# EasyEDA schematic 1-Schematic_WELCOME HOME PCB BOARD.json
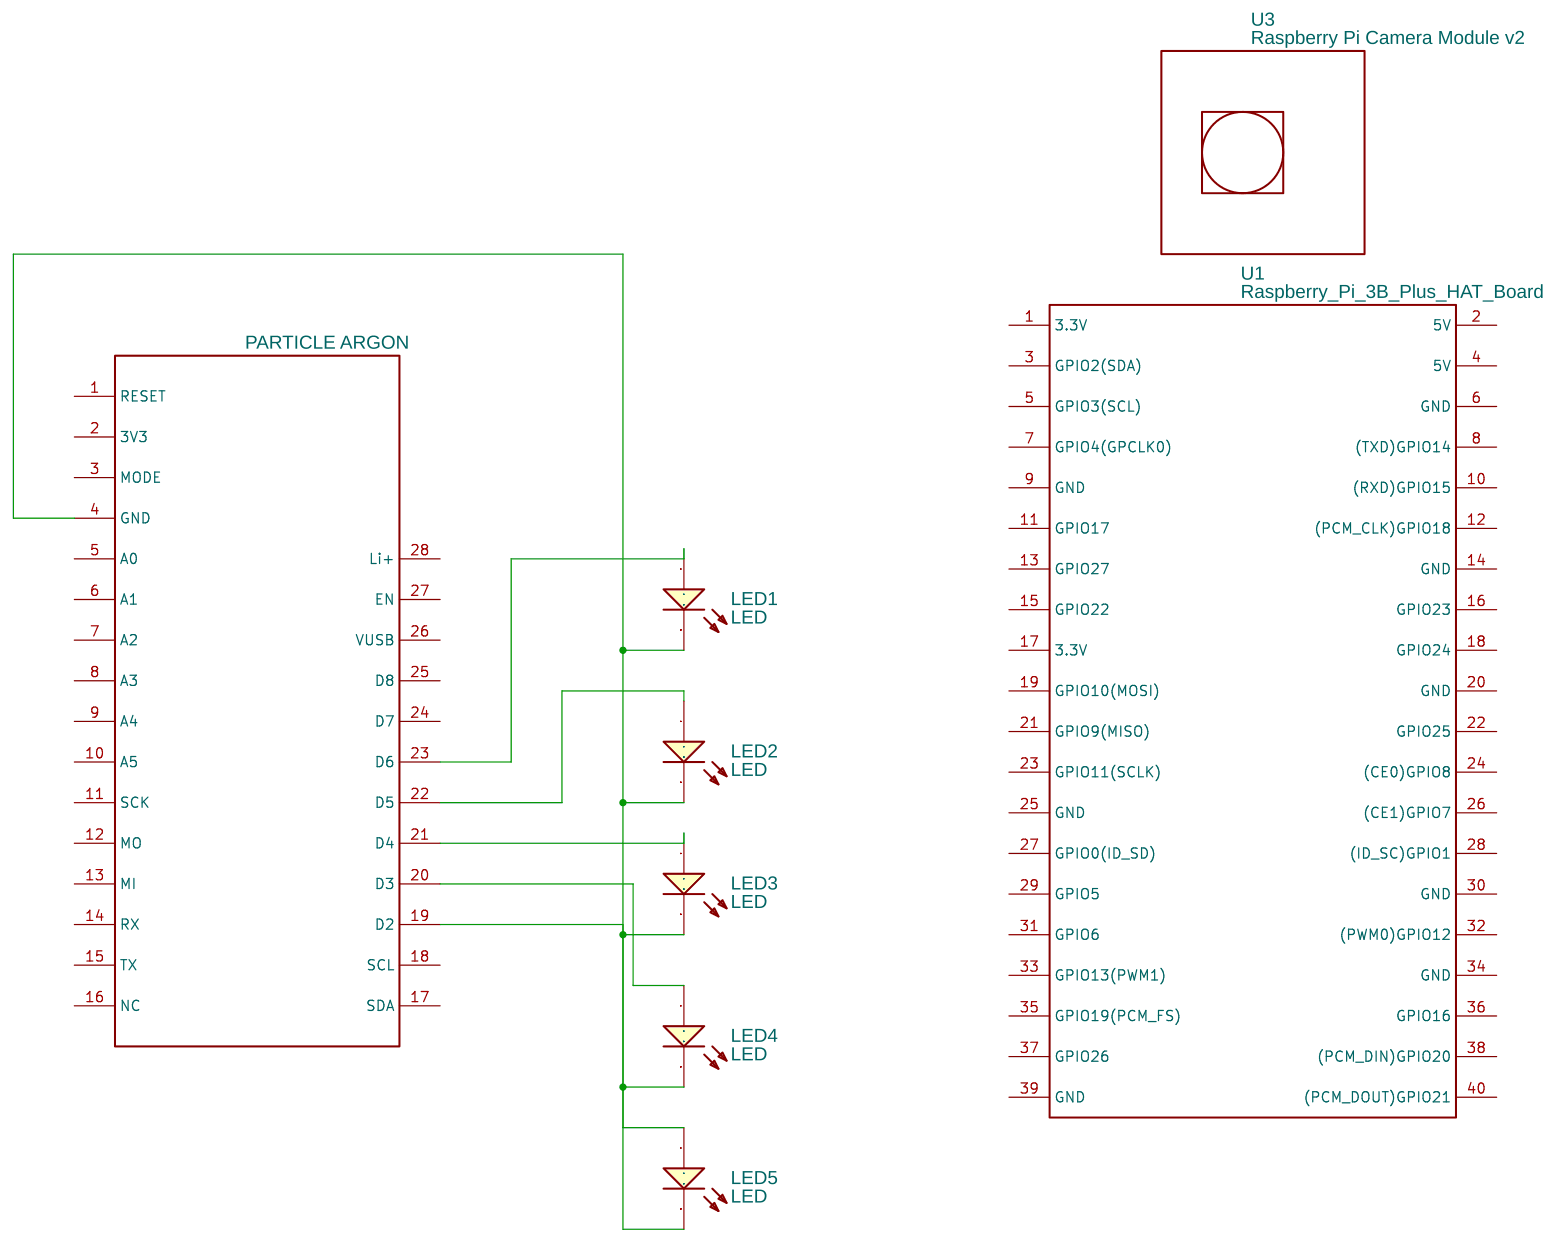
[diagram p0: schematic sheet]

## Parts
LED1  LED  [LED-3528]
LED2  LED  [LED-3528]
LED3  LED  [LED-3528]
LED4  LED  [LED-3528]
LED5  LED  [LED-3528]
U1  Raspberry_Pi_3B_Plus_HAT_Board  [RASPBERRY_PI_3B_PLUS_HAT_BOARD]
U2  PARTICLE ARGON  [PARTICLE_XENON]
U3  Raspberry Pi Camera Module v2  [RASPBERRY PI CAMERA MODULE V2]

## Library data of the parts
LED1-LED5 = LED: Supplier Part: C69273; Supplier: LCSC; Manufacturer: ReliaPro; Manufacturer Part: LEDBlue light; image: http://image.lceda.cn/szlcsc/C69273.jpg
U1 = Raspberry_Pi_3B_Plus_HAT_Board: catid: 20; Contributor: lwweb; Manufacturer Part: Raspberry-Pi-3B-Plus-HAT-Board
U2 = PARTICLE ARGON: Contributor: farm21
U3 = Raspberry Pi Camera Module v2: Contributor: tunx404

## Nets
Net-(LED1-1): LED1.1 U2.23(D6)
Net-(LED1-2): LED1.2 LED2.2 LED3.2 LED4.2 LED5.1 LED5.2 U2.4(GND) U2.19(D2)
Net-(LED2-1): LED2.1 U2.22(D5)
Net-(LED3-1): LED3.1 U2.21(D4)
Net-(LED4-1): LED4.1 U2.20(D3)

Not connected (* = marked no-connect by the designer): U1 1(3.3V) 2(5V) 3(GPIO2(SDA)) 4(5V) 5(GPIO3(SCL)) 6(GND) 7(GPIO4(GPCLK0)) 8((TXD)GPIO14) 9(GND) 10((RXD)GPIO15) 11(GPIO17) 12((PCM_CLK)GPIO18) 13(GPIO27) 14(GND) 15(GPIO22) 16(GPIO23) 17(3.3V) 18(GPIO24) 19(GPIO10(MOSI)) 20(GND) 21(GPIO9(MISO)) 22(GPIO25) 23(GPIO11(SCLK)) 24((CE0)GPIO8) 25(GND) 26((CE1)GPIO7) 27(GPIO0(ID_SD)) 28((ID_SC)GPIO1) 29(GPIO5) 30(GND) 31(GPIO6) 32((PWM0)GPIO12) 33(GPIO13(PWM1)) 34(GND) 35(GPIO19(PCM_FS)) 36(GPIO16) 37(GPIO26) 38((PCM_DIN)GPIO20) 39(GND) 40((PCM_DOUT)GPIO21); U2 1(RESET) 2(3V3) 3(MODE) 5(A0) 6(A1) 7(A2) 8(A3) 9(A4) 10(A5) 11(SCK) 12(MO) 13(MI) 14(RX) 15(TX) 16(NC) 17(SDA) 18(SCL) 24(D7) 25(D8) 26(VUSB) 27(EN) 28(Li+)
